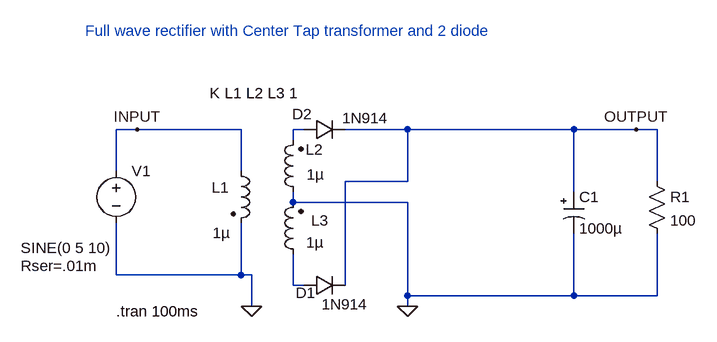
[diagram p0: schematic Full Wave Rectifier with tranfromer.asc]
Full Wave Rectifier with tranfromer.asc, the LTspice schematic file:
Version 4
SHEET 1 900 680
WIRE 32 48 0 48
WIRE 192 48 32 48
WIRE 288 48 272 48
WIRE 448 48 352 48
WIRE 704 48 448 48
WIRE 800 48 704 48
WIRE 832 48 800 48
WIRE 272 64 272 48
WIRE 0 112 0 48
WIRE 192 112 192 48
WIRE 448 128 448 48
WIRE 448 128 352 128
WIRE 832 128 832 48
WIRE 704 144 704 48
WIRE 272 160 272 144
WIRE 448 160 272 160
WIRE 0 272 0 192
WIRE 192 272 192 192
WIRE 192 272 0 272
WIRE 208 272 192 272
WIRE 272 288 272 240
WIRE 288 288 272 288
WIRE 352 288 352 128
WIRE 448 304 448 160
WIRE 704 304 704 208
WIRE 704 304 448 304
WIRE 832 304 832 208
WIRE 832 304 704 304
WIRE 208 320 208 272
WIRE 448 320 448 304
FLAG 208 320 0
FLAG 448 320 0
FLAG 32 48 INPUT
FLAG 800 48 OUTPUT
SYMBOL res 816 112 R0
SYMATTR InstName R1
SYMATTR Value 100
SYMBOL ind2 176 96 R0
WINDOW 0 -29 41 Left 2
WINDOW 3 -28 111 Left 2
SYMATTR InstName L1
SYMATTR Value 1µ
SYMATTR Type ind
SYMBOL ind2 288 160 R180
WINDOW 0 -30 81 Left 2
WINDOW 3 -32 43 Left 2
SYMATTR InstName L2
SYMATTR Value 1µ
SYMATTR Type ind
SYMBOL diode 288 64 R270
WINDOW 0 24 -2 VTop 2
WINDOW 3 49 95 VBottom 2
SYMATTR InstName D2
SYMATTR Value 1N914
SYMBOL ind2 288 256 R180
WINDOW 0 -39 68 Left 2
WINDOW 3 -31 34 Left 2
SYMATTR InstName L3
SYMATTR Value 1µ
SYMATTR Type ind
SYMBOL diode 288 304 R270
WINDOW 0 -11 3 VTop 2
WINDOW 3 2 64 VBottom 2
SYMATTR InstName D1
SYMATTR Value 1N914
SYMBOL voltage 0 96 R0
WINDOW 3 -147 134 Left 2
WINDOW 123 0 0 Left 0
WINDOW 39 -147 162 Left 2
SYMATTR Value SINE(0 5 10)
SYMATTR SpiceLine Rser=.01m
SYMATTR InstName V1
SYMBOL polcap 688 144 R0
WINDOW 3 24 56 Left 2
SYMATTR InstName C1
SYMATTR Value 1000µ
SYMATTR Description Capacitor
SYMATTR Type cap
SYMATTR SpiceLine V=16 Irms=0 Rser=11 Lser=0
TEXT 0 328 Left 2 !.tran 100ms
TEXT -48 -104 Left 2 ;Full wave rectifier with Center Tap transformer and 2 diode
TEXT 144 -8 Left 2 !K L1 L2 L3 1

The netlist it stands for:
* Full Wave Rectifier with tranfromer.asc
R1 OUTPUT 0 100
L1 INPUT 0 1µ
L2 0 N001 1µ
D2 N001 OUTPUT 1N914
L3 N002 0 1µ
D1 N002 OUTPUT 1N914
V1 INPUT 0 SINE(0 5 10) Rser=.01m
C1 OUTPUT 0 1000µ V=16 Irms=0 Rser=11 Lser=0
.model D D
.lib standard.dio
.tran 100ms
* Full wave rectifier with Center Tap transformer and 2 diode
K L1 L2 L3 1
.backanno
.end

* Results of the author's LTspice run, read from the files saved beside the schematic
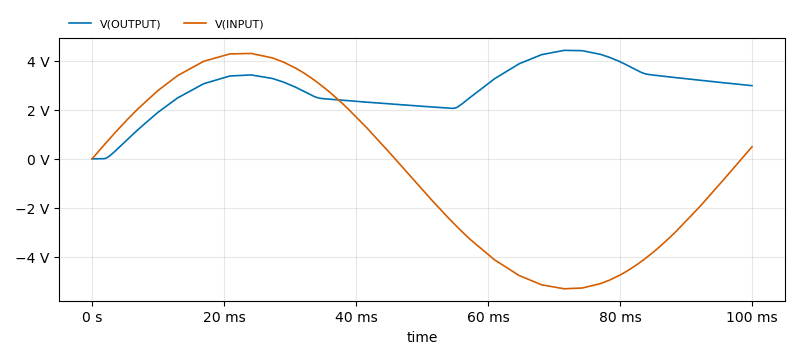
[diagram p1: Transient Analysis of Full Wave Rectifier with tranfromer.asc, plotted from the saved traces]
* Transient Analysis, 1 run:
*   V(OUTPUT): min 0 V, max 4.428 V, average 2.869 V, rms 3.039 V, last 2.988 V
*   V(INPUT): min -5.309 V, max 4.303 V, average -491 mV, rms 3.416 V, last 490.6 mV